# Altium schematic sheet CH2-Input.SchDoc: CH2 INPUT
size A4; Author: MOG; CompanyName: GIE GROUP; DrawnBy: MOG; Organization: Gie SA; Address1: Galicia 52; Address2: Mar del Plata; Address3: Buenos Aires; Address4: Argentina; DocumentNumber: 4; Revision: 0.0; SheetNumber: 5; SheetTotal: 14; Project: CP DATALOGGER; PageSetup: Record=PageOptions|CenterHorizontal=True|CenterVertical=True|PrintScale=0.94|XCorrection=1.00|YCorrection=1.00|PrintKind=0|BorderSize=5000000|LeftOffset=0|BottomOffset=0|Orientation=2|PaperLength=1000|PaperWidth=1000|Scale=100|PaperSource=7|PrintQuality=720|MediaType=1|DitherType=10|PaperKind=A4|PrintScaleMode=1
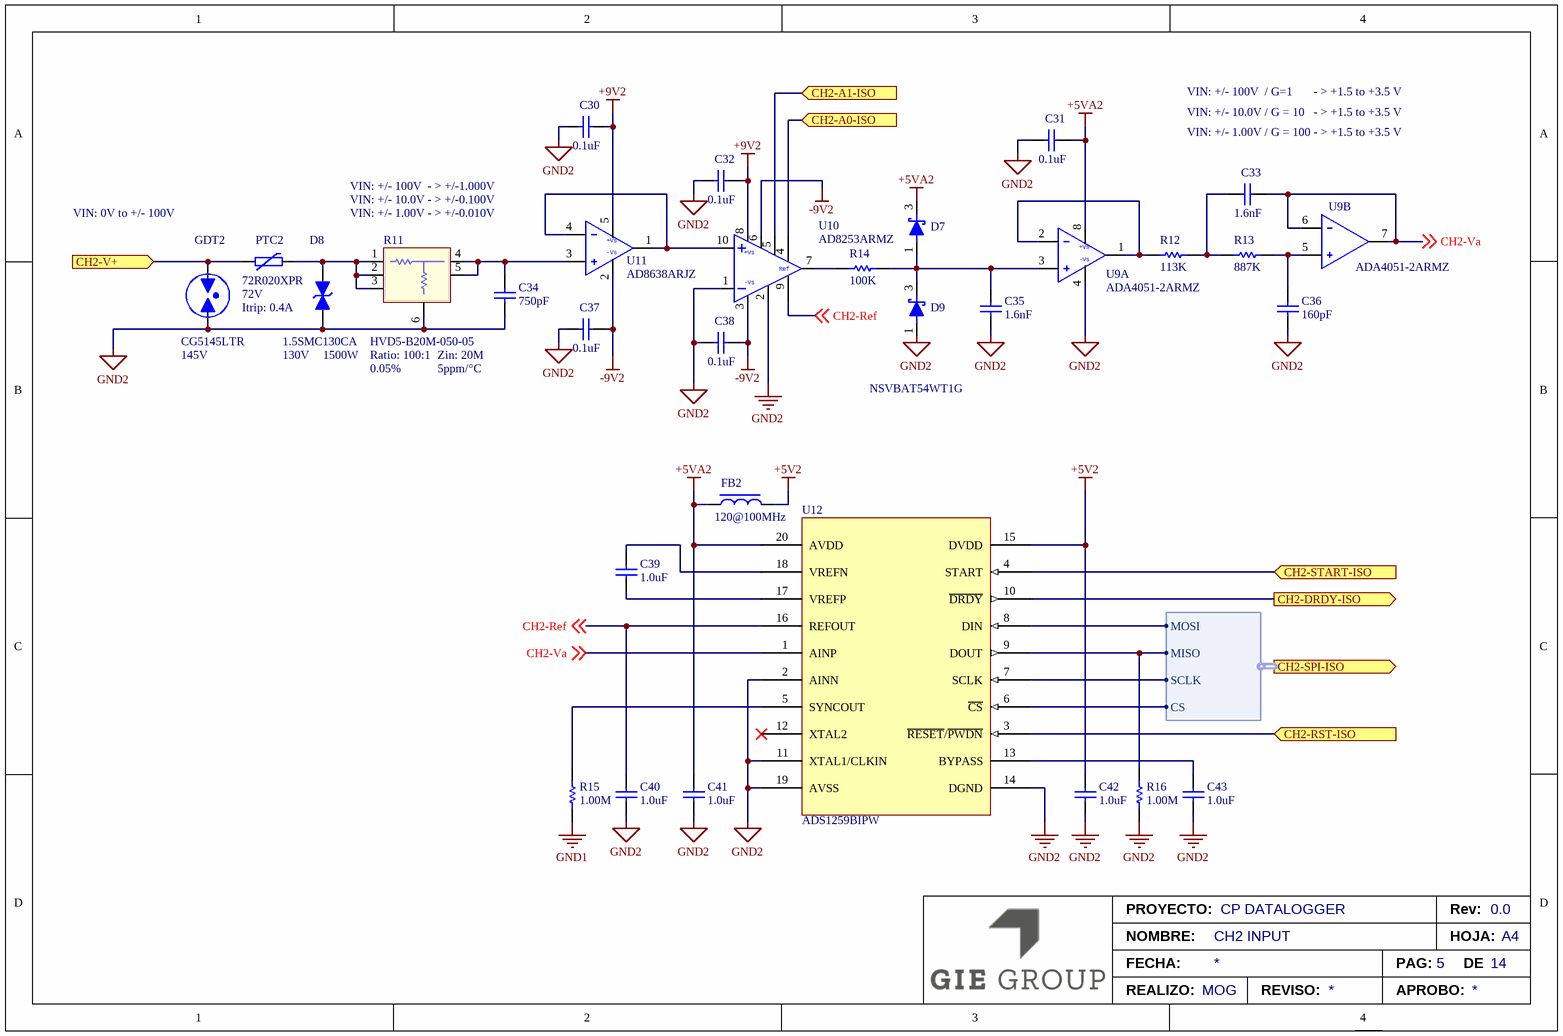
[diagram p0: CH2-Input.SchDoc]

## Parts
C30  value 0.1uF  [CAP-0603]  (hidden comment: C0603C104K5RACAUTO)
C31  value 0.1uF  [CAP-0603]  (hidden comment: C0603C104K5RACAUTO)
C32  value 0.1uF  [CAP-0603]  (hidden comment: C0603C104K5RACAUTO)
C33  value 1.6nF  [CAP-0603]  (hidden comment: C0603C162J5GAC7867)
C34  value 750pF  [CAP-0603]  (hidden comment: C0603C161J1GAC7867)
C35  value 1.6nF  [CAP-0603]  (hidden comment: C0603C162J5GAC7867)
C36  value 160pF  [CAP-0603]  (hidden comment: C0603C161J1GAC7867)
C37  value 0.1uF  [CAP-0603]  (hidden comment: C0603C104K5RACAUTO)
C38  value 0.1uF  [CAP-0603]  (hidden comment: C0603C104K5RACAUTO)
C39  value 1.0uF  [CAP-0603]  (hidden comment: C0603C105M3RAC7867)
C40  value 1.0uF  [CAP-0603]  (hidden comment: C0603C105M3RAC7867)
C41  value 1.0uF  [CAP-0603]  (hidden comment: C0603C105M3RAC7867)
C42  value 1.0uF  [CAP-0603]  (hidden comment: C0603C105M3RAC7867)
C43  value 1.0uF  [CAP-0603]  (hidden comment: C0603C105M3RAC7867)
D7  NSVBAT54WT1G  [SOT-323-3]  (value not drawn)
D8  Voltage: 130V  Power: 1500W  [SMC - BIIDIR]  (hidden comment: 1.5SMC130CA)
D9  NSVBAT54WT1G  [SOT-323-3]
FB2  value 120@100MHz  [IND-0603]  (hidden comment: Z0603C121GPWZT)
GDT2  Voltage: 145V  [LITTLELFUSE-CG5XXXLTR]  (hidden comment: CG5145LTR)
PTC2  Voltage: 72V  Itrip: 0.4A  [LITTLELFUSE-72R020X]  (hidden comment: 72R020XPR)
R11  Thermal: 5ppm/°C  Tolerance: 0.05%  Ratio: 100:1  Zin: 20M  [CADDOCK - HVD5-B20M-050-05]  (hidden comment: HVD5-B20M-050-05)
R12  value 113K  [RES-0603]  (hidden comment: RC0603FR-07113KL)
R13  value 887K  [RES-0603]  (hidden comment: RC0603FR-07887KL)
R14  value 100K  [RES-0603]  (hidden comment: RC0603FR-07100KL)
R15  value 1.00M  [RES-0603]  (hidden comment: RC0603FR-071ML)
R16  value 1.00M  [RES-0603]  (hidden comment: RC0603FR-071ML)
U9  ADA4051-2ARMZ  [MSOP8]  (parts A,B of 2)
U10  AD8253ARMZ  [MSOP10]
U11  AD8638ARJZ  [SOT23-5]
U12  ADS1259BIPW  [TSSOP20]

## Ports
CH2-A0-ISO (in), CH2-A1-ISO (in), CH2-DRDY-ISO (out), CH2-RST-ISO (in), CH2-SPI-ISO (out, harness CH2-SPI-ISO), CH2-START-ISO (in), CH2-V+ (in)

## Harnesses
CH2-SPI-ISO: MOSI, MISO, SCLK, CS

## Nets
+5V2: C42.2 FB2.2 U12.15(DVDD)
+5VA2: C31.2 C41.2 D7.3(K) FB2.1 U9.8(+VS) U12.20(AVDD)
+9V2: C30.2 C32.2 U10.8(+Vs) U11.5(+VS)
-9V2: C37.2 C38.2 U10.3(-Vs) U10.6(WR) U11.2(-Vs)
GND1: R15.1
GND2: C30.1 C31.1 C32.1 C34.1 C35.1 C36.1 C37.1 C38.1 C40.1 C41.1 C42.1 C43.1 D8.2(K) D9.1(A) GDT2.2(K) R11.6 R16.1 U9.4(-Vs) U10.1(-_IN) U10.2(DGND) U12.2(AINN) U12.11(XTAL1/CLKIN) U12.14(DGND) U12.19(AVSS)
CH2-A0-ISO: U10.4(A0) ; port CH2-A0-ISO
CH2-A1-ISO: U10.5(A1) ; port CH2-A1-ISO
CH2-DRDY-ISO: U12.10(~{DRDY}) ; port CH2-DRDY-ISO
CH2-Ref: C40.2 U10.9(REF) U12.16(REFOUT) ; off-sheet CH2-Ref
CH2-RST-ISO: U12.3(~{RESET}/~{PWDN}) ; port CH2-RST-ISO
CH2-START-ISO: U12.4(START) ; port CH2-START-ISO
CH2-V+: GDT2.1(A) PTC2.1 ; port CH2-V+
CH2-Va: C33.1 U9.6(-INB) U9.7(OUTB) U12.1(AINP) ; off-sheet CH2-Va
NetC33_2: C33.2 R12.2 R13.1
NetC34_2: C34.2 R11.4 R11.5 U11.3(+IN)
NetC35_2: C35.2 D7.1(A) D9.3(K) R14.2 U9.3(+INA)
NetC36_2: C36.2 R13.2 U9.5(+INB)
NetC39_1: C39.1 U12.17(VREFP)
NetC39_2: C39.2 U12.18(VREFN)
NetC43_2: C43.2 U12.13(BYPASS)
NetD8_1: D8.1(A) PTC2.2 R11.1 R11.2 R11.3
NetR12_1: R12.1 U9.1(OUTA) U9.2(-INA)
NetR14_1: R14.1 U10.7(OUT)
NetR15_2: R15.2 U12.5(SYNCOUT)
NetR16_2: R16.2 U12.9(DOUT) ; port CH2-SPI-ISO.MISO
NetU10_10: U10.10(+_IN) U11.1(OUT) U11.4(-IN)
NetU12_6: U12.6(~{CS}) ; port CH2-SPI-ISO.CS
NetU12_7: U12.7(SCLK) ; port CH2-SPI-ISO.SCLK
NetU12_8: U12.8(DIN) ; port CH2-SPI-ISO.MOSI

Not connected (* = marked no-connect by the designer): U12 12(XTAL2)*

## Notes on the sheet
- VIN: +/- 100V  / G=1       - > +1.5 to +3.5 V
- VIN: +/- 10.0V / G = 10   - > +1.5 to +3.5 V
- VIN: +/- 1.00V / G = 100 - > +1.5 to +3.5 V
- VIN: 0V to +/- 100V
- VIN: +/- 100V  - > +/-1.000V
- VIN: +/- 10.0V - > +/-0.100V
- (near R11) VIN: +/- 1.00V - > +/-0.010V
- PROYECTO:
- Rev:
- NOMBRE:
- FECHA:
- REALIZO:
- REVISO:
- APROBO:
- PAG:
- HOJA:
- DE
- A4
- (in symbol AD8253ARMZ) Ref
- (in symbol AD8638ARJZ) +Vs
- (in symbol ADA4051-2ARMZ, part A) +Vs

## Library data of the parts
C30-C32 C37 C38 = C0603C104K5RACAUTO: CAP CER 0.1uF 50V X7R 0603; Manufacturer: Kemet; Tolerance: 10%; Voltage: 50; PartNumber: C0603C104K5RACAUTO; Supplier 1: Digi-Key; Supplier 2: Mouser; Supplier Part Number 1: 399-6856-1-ND; Supplier Part Number 2: 80-C0603C104K5RAUTO
C33 C35 = C0603C162J5GAC7867: CAP CER 1600´pF 50V C0G 0603; Manufacturer: Kemet; Tolerance: 5%; Voltage: 50; PartNumber: C0603C162J5GAC7867; Supplier 1: Digi-Key; Supplier 2: Mouser; Supplier Part Number 1: 399-15368-1-ND; Supplier Part Number 2: 80-C0603C162J5G
C34 = C0603C751J5GAC7867: CAP CER 750´pF 50V C0G 0603; Manufacturer: Kemet; Tolerance: 5%; PartNumber: C0603C161J1GAC7867; Voltage: 50V; Supplier 1: Digi-Key; Supplier 2: Mouser; Supplier Part Number 1: 399-C0603C751J5GAC7867CT-ND; Supplier Part Number 2: 80-C0603C751J5G
C36 = C0603C161J1GAC7867: CAP CER 160 pF 100V C0G 0603; Manufacturer: Kemet; Tolerance: 5%; PartNumber: C0603C161J1GAC7867; Voltage: 100V; Supplier 1: Digi-Key; Supplier Part Number 1: 399-15367-1-ND
C39-C43 = C0603C105M3RAC7867: CAP CER 1uF 25V X7R 0603; Manufacturer: Kemet; Tolerance: 20%; Voltage: 25; PartNumber: C0603C105M3RAC7867; Supplier 1: Digi-Key; Supplier 2: Mouser; Supplier Part Number 1: 399-C0603C105M3RAC7867CT-ND; Supplier Part Number 2: 80-C0603C105M3R
D7 D9 = NSVBAT54WT1G: Schottky Diode 30V 200mA SOT323; Manufacturer: OnSemiconductor; IF(avg): 0.2A; VR(rms): 30V; Supplier 1: Digi-Key; Supplier 2: Mouser; Supplier Part Number 1: NSVBAT54WT1GOSDKR-ND; Supplier Part Number 2: 863-NSVBAT54WT1G; PartNumber: NSVBAT54WT1G
D8 = 1.5SMC130CA: TVS Diode 1.5kW 130V 5% Bi-Directional; Manufacturer: Littelfuse; Supplier 1: Digi-Key; Supplier 2: Mouser; Supplier Part Number 1: 1.5SMC130CACT-ND; Supplier Part Number 2: 576-1.5SMC130CA; PartNumber: 1.5SMC130CA
FB2 = Z0603C121GPWZT: Ferrite Bead 120Ohms 900mA 25% DCR=130m; Manufacturer: Kemet; PartNumber: Z0603C121GPWZT; Supplier 1: Digi-Key; Supplier 2: Mouser; Supplier Part Number 1: 399-Z0603C121GPWZTCT-ND; Supplier Part Number 2: 80-Z0603C121GPWZT
GDT2 = CG5145LTR: Gas Discharge Tube 145V; Manufacturer: Littelfuse; Supplier 1: Digi-Key; Supplier 2: Mouser; Supplier Part Number 1: CG5145LTR-ND; Supplier Part Number 2: 576-CG5145LTR; PartNumber: CG5145LTR
PTC2 = 72R020XPR: PTC Polyfuse Radial 72V 0.2A; Manufacturer: Littlelfuse; Ihold: 0.2A; Supplier 1: Digi-Key; Supplier 2: Mouser; Supplier Part Number 1: 72R020XPRCT-ND; Supplier Part Number 2: 576-72R020XPR; PartNumber: 72R020XPR
R11 = HVD5-B20M-050-05: 20M ohm 0.05% 5ppm Voltage Divider; Manufacturer: Caddock; Supplier 1: Digi-Key; Supplier 2: Mouser; Supplier Part Number 1: HVD5-B20M-050-05-ND; Supplier Part Number 2: 684-HVD5-B20M; PartNumber: HVD5-B20M-050-05
R12 = RC0603FR-07113KL: RES SMD 113K OHM 1% 1/10W 0603; Manufacturer: Yageo; Power: 0.1W; Tolerance: 1%; PartNumber: RC0603FR-07113KL; Supplier 1: Digi-Key; Supplier 2: Mouser; Supplier Part Number 2: 603-RC0603FR-07113KL; Supplier Part Number 1: 311-113KHRCT-ND
R13 = RC0603FR-07887KL: RES SMD 887K OHM 1% 1/10W 0603; Manufacturer: Yageo; Power: 0.1W; Tolerance: 1%; PartNumber: RC0603FR-07887KL; Supplier 1: Digi-Key; Supplier 2: Mouser; Supplier Part Number 1: 311-887KHRCT-ND; Supplier Part Number 2: 603-RC0603FR-07887KL
R14 = RC0603FR-07100KL: RES SMD 100K OHM 1% 1/10W 0603; Manufacturer: Yageo; Power: 0.1W; Tolerance: 1%; PartNumber: RC0603FR-07100KL; Supplier 1: Digi-Key; Supplier 2: Mouser; Supplier Part Number 1: 311-100KHRCT-ND; Supplier Part Number 2: 603-RC0603FR-07100KL
R15 R16 = RC0603FR-071ML: RES SMD 1M OHM 1% 1/10W 0603; Manufacturer: Yageo; Power: 0.1W; Tolerance: 1%; PartNumber: RC0603FR-071ML; Supplier 1: Digi-Key; Supplier 2: Mouser; Supplier Part Number 1: 311-887KHRCT-ND; Supplier Part Number 2: 603-RC0603FR-07887KL
U9 = ADA4051-2ARMZ: Dual  Precision Amplifier Micro Power Auto Zero; Manufacturer: Analog Devices; Supplier 1: Digi-Key; Supplier 2: Mouser; Supplier Part Number 1: 505-ADA4051-2ARMZ-ND; Supplier Part Number 2: 584-ADA4051-2ARMZ; PartNumber: ADA4051-2ARMZ
U10 = AD8253ARMZ: Instrumentation Amplifiers High Speed Programmable High Gain In-Amp; Manufacturer: Analog Devices Inc; PartNumber: AD8253ARMZ; Supplier 1: Digi-Key; Supplier 2: Mouser; Supplier Part Number 1: 505-AD8253ARMZ-R7DKR-ND; Supplier Part Number 2: 584-AD8253ARMZ-R7
U11 = AD8638ARJZ: 16V Auto-Zero CMOS Amplifier; Manufacturer: Analog Devices; Supplier 1: Digi-Key; Supplier 2: Mouser; Supplier Part Number 1: 505-AD8638ARJZ-REEL7DKR-ND; Supplier Part Number 2: 584-AD8638ARJZ-R7; PartNumber: AD8638ARJZ
U12 = ADS1259BIPW: Analog to Digital Converter 14.4kSPS 24-Bit; Manufacturer: Texas Instruments; Supplier 1: Digi-Key; Supplier 2: Mouser; Supplier Part Number 1: 296-27183-5-ND; Supplier Part Number 2: 595-ADS1259BIPW; PartNumber: ADS1259BIPW